# EAGLE design breakout-DS (EAGLE 6.1)
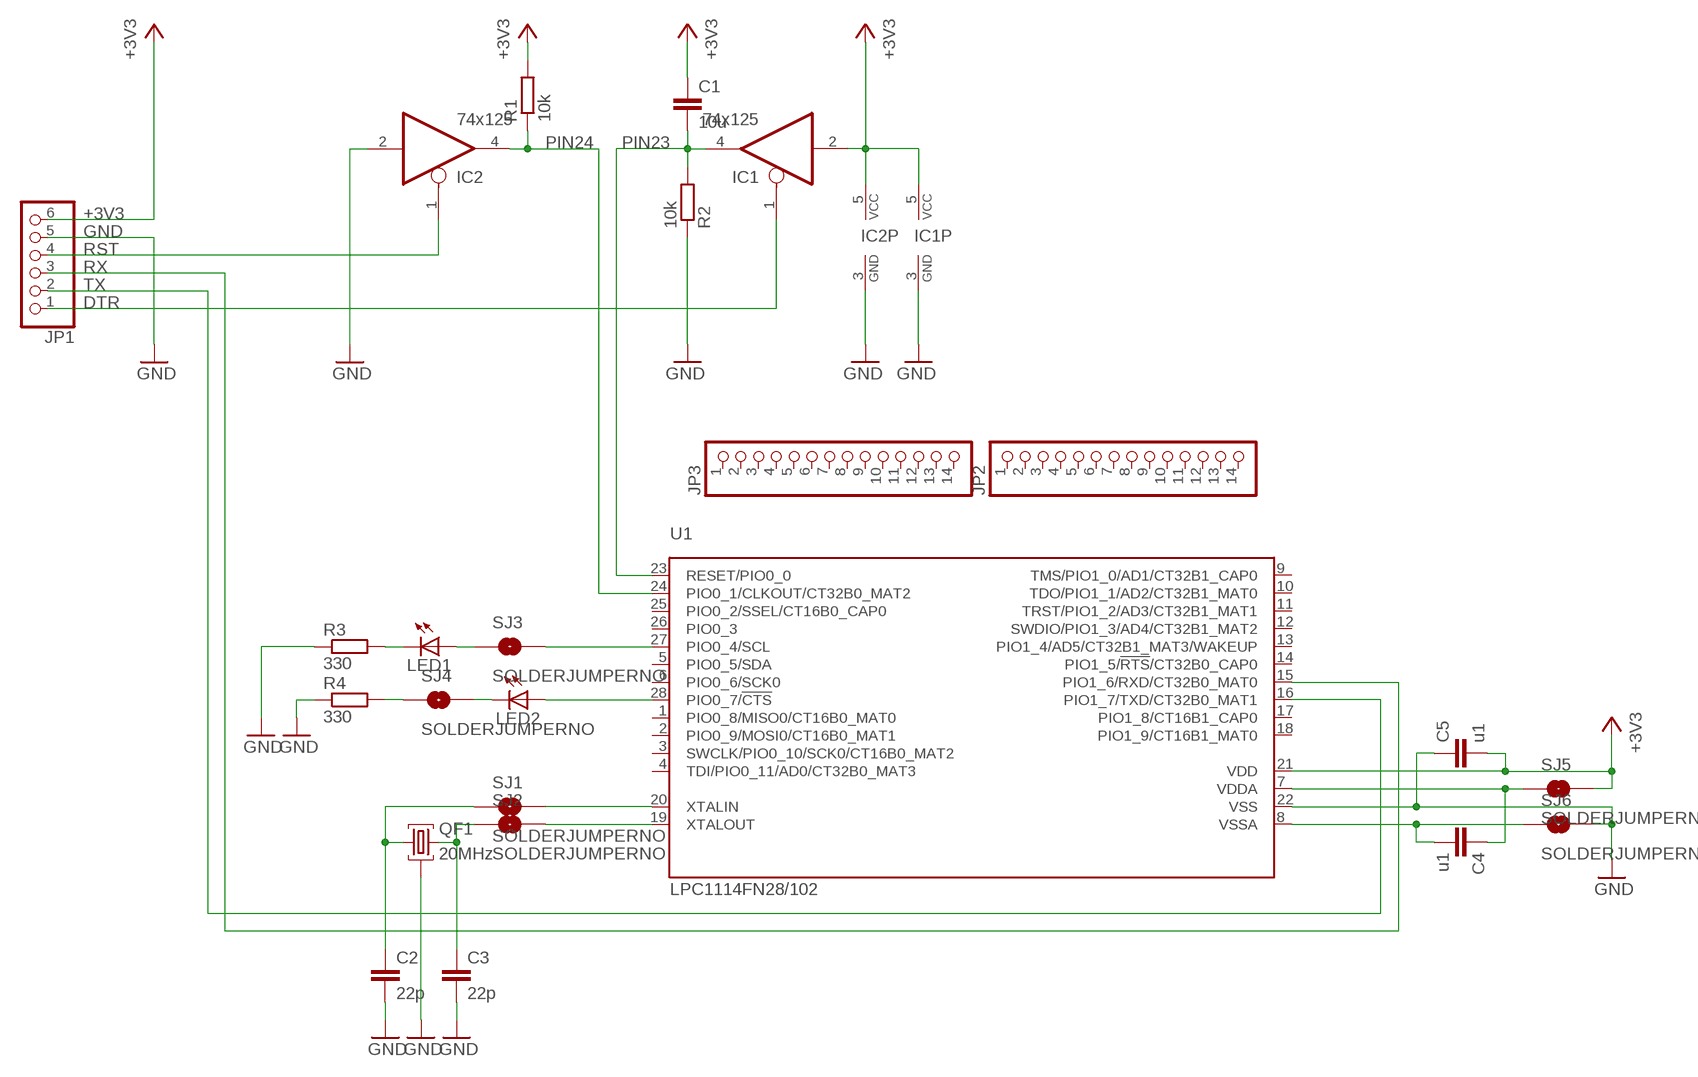
[diagram p0: schematic, sheet 1]

## Parts
C1  10u  C-EUC0805K  [C0805K]
C2  22p  C-EUC0805K  [C0805K]
C3  22p  C-EUC0805K  [C0805K]
C4  u1  C-EUC0805K  [C0805K]
C5  u1  C-EUC0805K  [C0805K]
IC1  74x125  74AHC1G125DBV  [SOT23-5]
IC2  74x125  74AHC1G125DBV  [SOT23-5]
JP1  PINHD-1X6/90  [1X06/90]
JP2  PINHD-1X14  [1X14]
JP3  PINHD-1X14  [1X14]
LED1  LEDLD260  [LD260]
LED2  LEDLD260  [LD260]
QF1  20MHz  10M7AHC49T  [HC49U]
R1  10k  R-EU_M0805  [M0805]
R2  10k  R-EU_M0805  [M0805]
R3  330  R-EU_M0805  [M0805]
R4  330  R-EU_M0805  [M0805]
SJ1  SOLDERJUMPERNO  [SJ_2S-NO]
SJ2  SOLDERJUMPERNO  [SJ_2S-NO]
SJ3  SOLDERJUMPERNO  [SJ_2S-NO]
SJ4  SOLDERJUMPERNO  [SJ_2S-NO]
SJ5  SOLDERJUMPERNO  [SJ_2S-NO]
SJ6  SOLDERJUMPERNO  [SJ_2S-NO]
U1  LPC1114FN28/102  [SOT117]

## Nets
+3V3: C1.1 C5.2 IC1.2(I) IC1.5(VCC) IC2.5(VCC) JP1.6 R1.2 SJ5.2 U1.21(VDD)
DTR: IC1.1(OE) JP1.1
GND: C2.2 C3.2 C5.1 IC1.3(GND) IC2.2(I) IC2.3(GND) JP1.5 QF1.2 R2.1 R3.1 R4.1 SJ6.2 U1.22(VSS)
N$1: LED2.A U1.28(PIO0_7/!CTS!)
N$2: LED1.A SJ3.1
N$3: LED1.K(C) R3.2
N$4: R4.2 SJ4.1
N$5: SJ2.2 U1.19(XTALOUT)
N$6: SJ1.2 U1.20(XTALIN)
N$7: LED2.K(C) SJ4.2
N$8: SJ3.2 U1.27(PIO0_4/SCL)
N$9: C3.1 QF1.3 SJ2.1
N$10: C2.1 QF1.1 SJ1.1
PIN7: C4.1 SJ5.1 U1.7(VDDA)
PIN8: C4.2 SJ6.1 U1.8(VSSA)
PIN23: C1.2 IC1.4(O) R2.2 U1.23(RESET/PIO0_0)
PIN24: IC2.4(O) R1.1 U1.24(PIO0_1/CLKOUT/CT32B0_MAT2)
RST: IC2.1(OE) JP1.4
RX: JP1.3 U1.15(PIO1_6/RXD/CT32B0_MAT0)
TX: JP1.2 U1.16(PIO1_7/TXD/CT32B0_MAT1)
Unconnected: JP2.1 JP2.2 JP2.3 JP2.4 JP2.5 JP2.6 JP2.7 JP2.8 JP2.9 JP2.10 JP2.11 JP2.12 JP2.13 JP2.14 JP3.1 JP3.2 JP3.3 JP3.4 JP3.5 JP3.6 JP3.7 JP3.8 JP3.9 JP3.10 JP3.11 JP3.12 JP3.13 JP3.14 U1.1(PIO0_8/MISO0/CT16B0_MAT0) U1.2(PIO0_9/MOSI0/CT16B0_MAT1) U1.3(SWCLK/PIO0_10/SCK0/CT16B0_MAT2) U1.4(TDI/PIO0_11/AD0/CT32B0_MAT3) U1.5(PIO0_5/SDA) U1.6(PIO0_6/SCK0) U1.9(TMS/PIO1_0/AD1/CT32B1_CAP0) U1.10(TDO/PIO1_1/AD2/CT32B1_MAT0) U1.11(TRST/PIO1_2/AD3/CT32B1_MAT1) U1.12(SWDIO/PIO1_3/AD4/CT32B1_MAT2) U1.13(PIO1_4/AD5/CT32B1_MAT3/WAKEUP) U1.14(PIO1_5/!RTS!/CT32B0_CAP0) U1.17(PIO1_8/CT16B1_CAP0) U1.18(PIO1_9/CT16B1_MAT0) U1.25(PIO0_2/SSEL/CT16B0_CAP0) U1.26(PIO0_3)

## Library data of the parts
C1-C5 = rcl:C-EU: CAPACITOR, European symbol
IC1 IC2 = 74xx-little-us:74*1G125: Single Bus Buffer Gate with 3-State Output
JP1 = pinhead:PINHD-1X6: PIN HEADER
JP2 JP3 = pinhead:PINHD-1X14: PIN HEADER
LED1 LED2 = led:LED: LED OSRAM: - CHIPLED LG R971, LG N971, LY N971, LG Q971, LY Q971, LO R971, LY R971 LH N974, LH R974 LS Q976, LO Q976, LY Q976 LO Q996 - Hyper CHIPLED LW Q18S LB Q993, LB Q99A, LB R99A - SideLED LS A670, LO A670, LY A670, LG A670, LP A670 LB A673, LV A673, LT A673, LW A673 LH A674 LY A675 LS A676, LA A676, LO A676, LY A676, LW A676 LS A679, LY A679, LG A679 - Hyper Micro SIDELED® LS Y876, LA Y876, LO Y876, LY Y876 LT Y87S - SmartLED LW L88C, LW L88S LB L89C, LB L89S, LG L890 LS L89K, LO L89K, LY L89K LS L896, LA L896, LO L896, LY L896 - TOPLED LS T670, LO T670, LY T670, LG T670, LP T670 LSG T670, LSP T670, LSY T670, LOP T670, LYG T670 LG T671, LOG T671, LSG T671 LB T673, LV T673, LT T673, LW T673 LH T674 LS T676, LA T676, LO T676, LY T676, LB T676, LH T676, LSB T676, LW T676 LB T67C, LV T67C, LT T67C, LS T67K, LO T67K, LY T67K, LW E67C LS E67B, LA E67B, LO E67B, LY E67B, LB E67C, LV E67C, LT E67C LW T67C LS T679, LY T679, LG T679 LS T770, LO T770, LY T770, LG T770, LP T770 LB T773, LV T773, LT T773, LW T773 LH T774 LS E675, LA E675, LY E675, LS T675 LS T776, LA T776, LO T776, LY T776, LB T776 LHGB T686 LT T68C, LB T68C - Hyper Mini TOPLED® LB M676 - Mini TOPLED Santana® LG M470 LS M47K, LO M47K, LY M47K Source: http://www.osram.convergy.de LUXEON: - LUMILED® LXK2-PW12-R00, LXK2-PW12-S00, LXK2-PW14-U00, LXK2-PW14-V00 LXK2-PM12-R00, LXK2-PM12-S00, LXK2-PM14-U00 LXK2-PE12-Q00, LXK2-PE12-R00, LXK2-PE12-S00, LXK2-PE14-T00, LXK2-PE14-U00 LXK2-PB12-K00, LXK2-PB12-L00, LXK2-PB12-M00, LXK2-PB14-N00, LXK2-PB14-P00, LXK2-PB14-Q00 LXK2-PR12-L00, LXK2-PR12-M00, LXK2-PR14-Q00, LXK2-PR14-R00 LXK2-PD12-Q00, LXK2-PD12-R00, LXK2-PD12-S00 LXK2-PH12-R00, LXK2-PH12-S00 LXK2-PL12-P00, LXK2-PL12-Q00, LXK2-PL12-R00 Source: www.luxeon.com KINGBRIGHT: KA-3528ASYC Source: www.kingbright.com
QF1 = crystal:10M*A: Monolithic Crystal Filters Source: www.vanlong.com; OC_FARNELL: unknown; OC_NEWARK: unknown
R1-R4 = rcl:R-EU_: RESISTOR, European symbol
SJ1-SJ6 = SparkFun-Passives:SOLDERJUMPER: Solder Jumper Standard SMD solder jumper. Used to automate production. Two varients : Normally Open and Normally Closed are the same, but have different paste layers. NC will have a large amount of paste and should jumper during reflow.
U1 = _MY_OWN_LIB:LPC1114FN28: 32-bit ARM Cortex-M0 microcontroller; up to 64 kB flash and 8 kB SRAM The LPC1110/11/12/13/14/15 are a ARM Cortex-M0 based, low-cost 32-bit MCU family, designed for 8/16-bit microcontroller applications, offering performance, low power, simple instruction set and memory addressing together with reduced code size compared to existing 8/16-bit architectures. The LPC1110/11/12/13/14/15 operate at CPU frequencies of up to 50 MHz. The peripheral complement of the LPC1110/11/12/13/14/15 includes up to 64 kB of flash memory, up to 8 kB of data memory, one Fast-mode Plus I 2 C-bus interface, one RS-485/EIA-485 UART, up to two SPI interfaces with SSP features, four general purpose counter/timers, a 10-bit ADC, and up to 42 general purpose I/O pins. Remark: The LPC111x series consists of the LPC1100 series (parts LPC111x/101/201/301), LPC1100L series (parts LPC111x/002/102/202/302), and the LPC1100XL series (parts LPC111x/103/203/303/323/333). The LPC1100L and LPC1100XL series include the power profiles, a windowed watchdog timer, and a configurable open-drain mode. AAL Eindhoven MK; ADC: 6; FLASH: 32kB; GPIO: 22; PWR_PROFILES: yes; SERIES: LPC1100L; SPI: 1; SRAM: 4kB

## Board
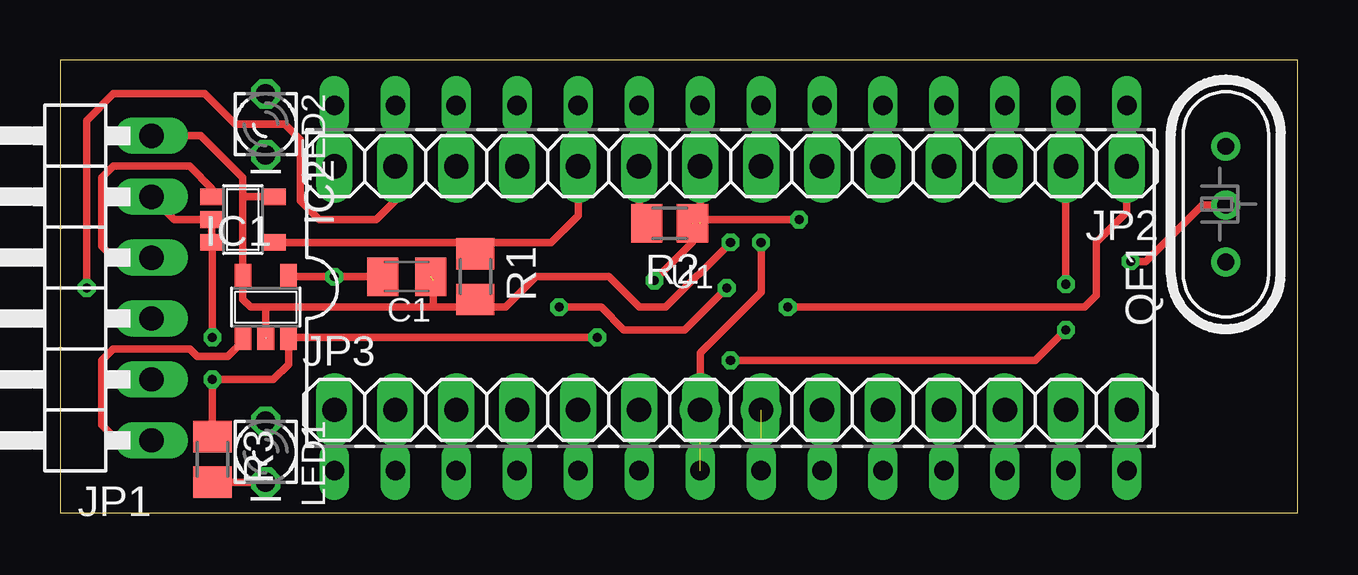
[diagram p1: board, top side]
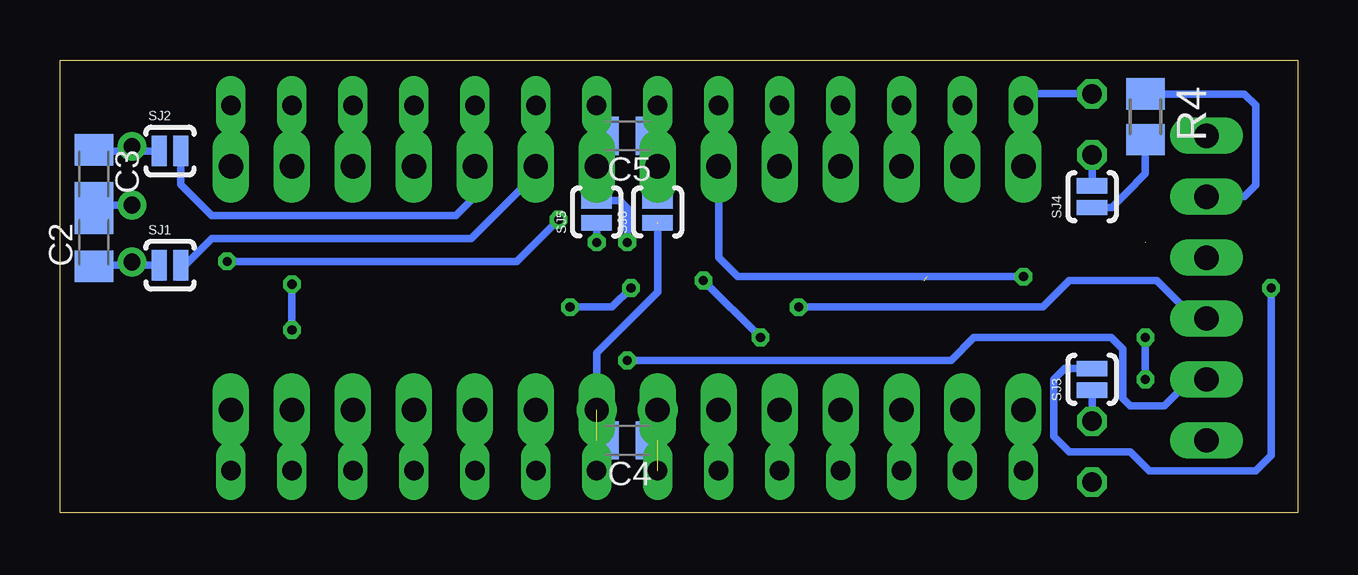
[diagram p2: board, bottom side, seen from below]

Size 51.57 x 18.88 mm. Coordinates in mm from the lower left corner, seen from the top.
Outline: 0,0 51.57,0 51.57,18.88 0,18.88 0,0
Copper layers (1*16): Top 0.0356mm / dielectric 1.5011mm / Bottom 0.0356mm
Design rules: minimum track width 6mil, minimum drill 13mil, track to track 6mil, track to pad 6mil, pad to pad 6mil, via to via 6mil, smd to smd 6mil, copper to edge 15mil, drill to drill 6mil, minimum pad ring 7mil, minimum via ring 7mil, stop-mask expansion 3mil, vias tented up to drill 0mil, thermal gap 10mil

### Footprints (pad centres in the part's own frame; a part is rotated, then mirrored left to right if it is on the bottom)
C0805K = smd 1.3 x 1.6: 1 -1,0; 2 1,0
SOT23-5 = smd 0.69 x 0.99: 1 -0.95,-1.29; 2 0,-1.29; 3 0.95,-1.29; 4 0.95,1.3; 5 -0.95,1.3
1X06/90 = drill 1.016 long: 1 -6.35,-3.81; 2 -3.81,-3.81; 3 -1.27,-3.81; 4 1.27,-3.81; 5 3.81,-3.81; 6 6.35,-3.81
1X14 = drill 1.016 long: 1 -16.51,0; 2 -13.97,0; 3 -11.43,0; 4 -8.89,0; 5 -6.35,0; 6 -3.81,0; 7 -1.27,0; 8 1.27,0; 9 3.81,0; 10 6.35,0; 11 8.89,0; 12 11.43,0; 13 13.97,0; 14 16.51,0
LD260 = drill 0.813 octagon: A -1.27,0; K 1.27,0
HC49U = drill 0.7 pad 1.2: 1 -2.413,0; 2 -0.027,0; 3 2.413,0
M0805 = smd 1.3 x 1.6: 1 -0.95,0; 2 0.95,0
SJ_2S-NO = smd 0.635 x 1.27: 1 -0.45,0; 2 0.45,0
SOT117 = drill 0.813 long: 1 -16.51,-7.62; 2 -13.97,-7.62; 3 -11.43,-7.62; 4 -8.89,-7.62; 5 -6.35,-7.62; 6 -3.81,-7.62; 7 -1.27,-7.62; 8 1.27,-7.62; 9 3.81,-7.62; 10 6.35,-7.62; 11 8.89,-7.62; 12 11.43,-7.62; 13 13.97,-7.62; 14 16.51,-7.62; 15 16.51,7.62; 16 13.97,7.62; 17 11.43,7.62; 18 8.89,7.62; 19 6.35,7.62; 20 3.81,7.62; 21 1.27,7.62; 22 -1.27,7.62; 23 -3.81,7.62; 24 -6.35,7.62; 25 -8.89,7.62; 26 -11.43,7.62; 27 -13.97,7.62; 28 -16.51,7.62

### Placement (x,y rotation side)
C1  14.45,9.84 180 top
C2  50.16,11.27 90 bottom
C3  50.16,14.13 270 bottom
C4  27.94,3.02 180 bottom
C5  27.94,15.72 180 bottom
IC1  8.57,8.57 0 top
IC2  7.62,12.22 270 top
JP1  0,9.37 90 top
JP2  27.94,14.45 180 top
JP3  27.94,4.29 0 top
LED1  8.57,2.54 270 top
LED2  8.57,16.19 270 top
QF1  48.58,12.86 90 top
R1  17.3,9.84 270 top
R2  25.4,12.06 180 top
R3  6.35,2.22 270 top
R4  6.35,16.51 270 bottom
SJ1  46.99,10.32 0 bottom
SJ2  46.99,15.08 0 bottom
SJ3  8.57,5.56 90 bottom
SJ4  8.57,13.18 90 bottom
SJ5  29.21,12.54 90 bottom
SJ6  26.67,12.54 90 bottom
U1  27.94,9.37 0 top

### Tracks (layer width: path | path; a pad name or v marks a point on that pad's centre or on a via)
+3V3  (via drill 0.38)  (1 unrouted)
  Top 0.305: 7.62,13.17 IC1.5 7.62,8.89 7.94,8.57 8.57,8.57 | IC2.5 7.62,13.17 | 7.62,13.17 7.62,13.18 7.62,13.97 5.87,15.72 JP1.6 | 8.57,8.1 IC1.2 8.57,8.57 | 8.57,8.57 15.56,8.57 | 15.56,8.57 15.56,9.68 | R1.2 17.3,8.57 | 15.56,8.57 17.3,8.57 | v27.94,11.27 25.24,8.57 24.13,8.57 22.86,9.84 19.84,9.84 18.57,8.57 17.3,8.57
  Bottom 0.305: 29.21,15.72 C5.2 28.94,16.99 U1.21 SJ5.2 29.18,13.02 28.26,13.02 27.94,12.7 v27.94,11.27
DTR
  Top 0.305: IC1.1 7.62,7.15 6.99,6.51 5.71,6.51 5.4,6.83 2.22,6.83 1.75,6.35 1.75,3.65 2.38,3.02 JP1.1
GND  (via drill 0.38)  (2 unrouted)
  Top 0.305: R3.1 v6.35,5.56 8.89,5.56 9.52,6.19 IC1.3 9.66,7.28 9.68,7.3 v22.38,7.3 | 6.35,11.25 IC2.3 IC2.2 4.76,12.22 JP1.5 | v6.35,7.3 6.35,11.27 | 48.55,12.83 QF1.2 47.6,12.83 45.24,10.48 v44.61,10.48 | v30.8,12.22 26.67,12.22 | 26.67,12.22 U1.22 | v24.77,9.68 26.35,11.27 R2.1 26.51,12.22 26.67,12.22
  Bottom 0.305: SJ6.2 U1.22 26.94,16.99 C5.1 | R4.1 2.22,17.46 1.75,16.99 1.75,13.65 2.22,13.18 JP1.5 | v6.35,5.56 v6.35,7.3 | QF1.2 50.14,12.83 50.16,12.86 | 50.16,12.86 C2.2 | 50.16,12.86 C3.2 | v44.61,10.48 32.54,10.48 v30.8,12.22 | v22.38,7.3 v24.77,9.68
N$1
  Bottom 0.305: LED2.A 10.95,17.46 U1.28
N$2
  Bottom 0.305: SJ3.1 LED1.A
N$3
  Top 0.305: R3.2 LED1.K
N$4
  Bottom 0.305: SJ4.1 7.75,12.73 7.14,13.34 6.35,14.13 R4.2
N$5
  Bottom 0.305: U1.19 34.29,13.18 35.08,12.38 45.24,12.38 46.54,13.68 SJ2.2
N$6
  Bottom 0.305: U1.20 31.75,14.13 34.45,11.43 45.24,11.43 46.35,10.32 SJ1.2
N$7
  Bottom 0.305: LED2.K SJ4.2
N$8  (via drill 0.38)
  Top 0.305: U1.27 13.97,13.02 13.18,12.22 10.79,12.22 10,13.02 10,15.56 9.37,16.19 7.3,16.19 6.03,17.46 2.22,17.46 1.11,16.35 v1.11,9.37
  Bottom 0.305: SJ3.2 9.71,6.01 10.16,5.56 10.16,3.17 9.53,2.54 6.99,2.54 6.19,1.75 1.75,1.75 1.11,2.38 v1.11,9.37
N$9
  Bottom 0.305: SJ2.1 48.26,15.08 | 48.26,15.08 50.12,15.08 C3.1 | QF1.3 48.45,15.27 48.26,15.08
N$10
  Bottom 0.305: SJ1.1 48.26,10.32 | 48.26,10.32 50.12,10.32 C2.1 | QF1.1 48.39,10.45 48.26,10.32
PIN7  (via drill 0.38, 0.6 pad 1.68)  (1 unrouted)
  Top 0.305: v29.21,11.27 29.21,9.21 26.67,6.67 v26.67,4.29
  Bottom 0.305: 26.67,3.02 C4.1 v26.67,4.29 | SJ5.1 v29.21,11.27
PIN8  (via drill 0.6 pad 1.68)  (2 unrouted)
  Bottom 0.305: C4.2 29.21,3.02 | U1.8 v29.21,4.29 29.21,6.67 26.67,9.21 26.67,12.06
PIN23  (via drill 0.38)
  Top 0.305: C1.2 v11.43,9.84 9.53,9.84 9.52,9.85 IC1.4 | R2.2 24.13,12.06 U1.23
  Bottom 0.305: v11.43,9.84 23.34,9.84 24.13,10.64 U1.23
PIN24
  Top 0.305: IC2.4 9.05,11.27 17.3,11.27 | R1.1 17.3,11.27 | 17.3,11.27 20.48,11.27 21.59,12.38 U1.24
RST
  Top 0.305: IC2.1 6.33,13.51 5.4,14.45 2.22,14.45 1.75,13.97 1.75,11.11 2.22,10.64 JP1.4
RX  (via drill 0.38)
  Top 0.305: U1.15 44.45,12.54 43.18,11.27 43.18,9.05 42.7,8.57 v30.32,8.57 | v27.78,9.37 26.04,7.62 23.5,7.62 22.54,8.57 v20.8,8.57
  Bottom 0.305: JP1.3 4.29,8.1 5.87,9.68 9.53,9.68 10.64,8.57 v20.8,8.57 | v30.32,8.57 28.57,8.57 v27.78,9.37
TX  (via drill 0.38)
  Top 0.305: U1.16 v41.91,9.53 | v41.91,7.62 40.64,6.35 v27.94,6.35
  Bottom 0.305: JP1.2 4.45,5.56 5.56,4.45 6.99,4.45 7.3,4.76 7.3,6.83 7.78,7.3 13.49,7.3 14.45,6.35 v27.94,6.35 | v41.91,9.53 v41.91,7.62